# Altium schematic sheet RAM.SchDoc
size A4; SheetNumber: 4
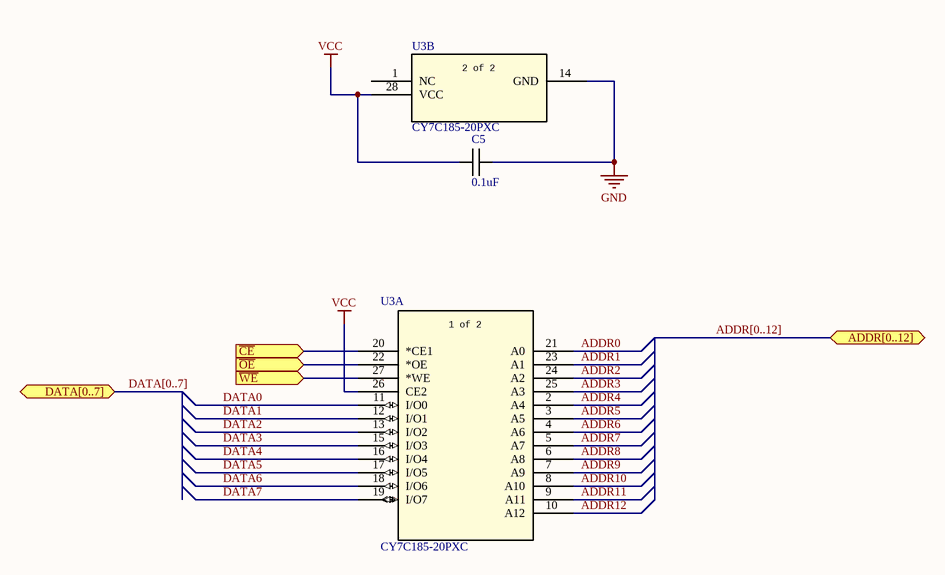
[diagram p0: RAM.SchDoc]

## Parts
C5  0.1uF  [SMD 0603]
U3  CY7C185-20PXC  [DIP-28]  (parts A,B of 2)

## Ports
ADDR[0..12] (bidir), DATA[0..7] (bidir), ~{CE} (in), ~{OE} (in), ~{WE} (in)

## Nets
GND: C5.2 U3.14(GND)
VCC: C5.1 U3.26(CE2) U3.28(VCC)
~{CE}: U3.20(*CE1) ; port ~{CE}
~{OE}: U3.22(*OE) ; port ~{OE}
~{WE}: U3.27(*WE) ; port ~{WE}
ADDR0: U3.21(A0)
ADDR1: U3.23(A1)
ADDR2: U3.24(A2)
ADDR3: U3.25(A3)
ADDR4: U3.2(A4)
ADDR5: U3.3(A5)
ADDR6: U3.4(A6)
ADDR7: U3.5(A7)
ADDR8: U3.6(A8)
ADDR9: U3.7(A9)
ADDR10: U3.8(A10)
ADDR11: U3.9(A11)
ADDR12: U3.10(A12)
DATA0: U3.11(I/O0)
DATA1: U3.12(I/O1)
DATA2: U3.13(I/O2)
DATA3: U3.15(I/O3)
DATA4: U3.16(I/O4)
DATA5: U3.17(I/O5)
DATA6: U3.18(I/O6)
DATA7: U3.19(I/O7)

Not connected (* = marked no-connect by the designer): U3 1(NC)

## Buses and harness runs
bus ADDR[0..12] = port ADDR[0..12]
bus DATA[0..7] = port DATA[0..7]

## Notes on the sheet
- (in symbol CY7C185-20PXC, part A) 1 of 2
- (in symbol CY7C185-20PXC, part B) 2 of 2

## Library data of the parts
C5 = Capasitor: Value: 0.1uF
U3 = CY7C185-20PXC: IC SRAM 64KBIT 20NS 28DIP; Built_By: EMA_UL_Team; Vendor: Cypress Semiconductor; Manufacturer_Part_Number: CY7C185-20PXC; RefDes: RefDes; Type: DEV; Value: Value